# Altium schematic sheet Magnetic_Encoder.SchDoc
size A
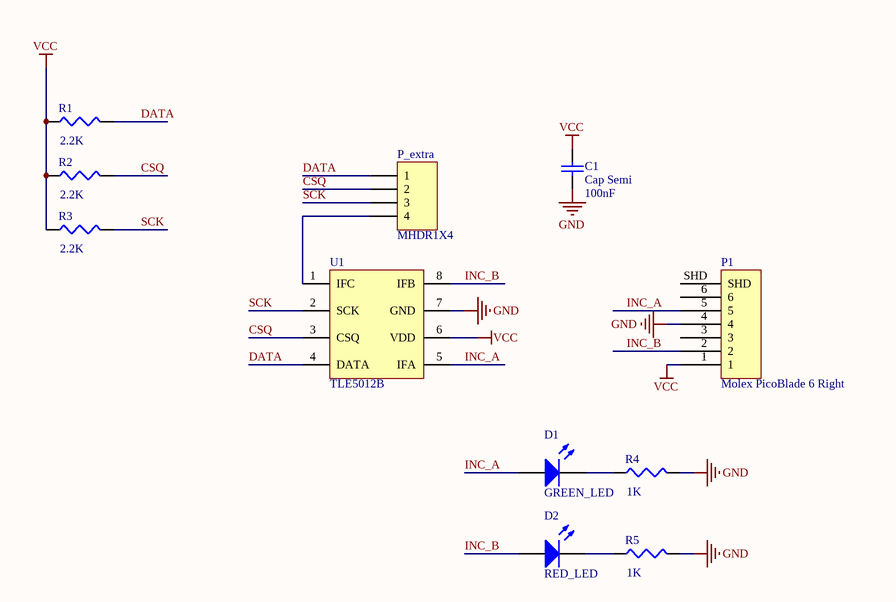
[diagram p0: Magnetic_Encoder.SchDoc]

## Parts
C1  Cap Semi  value 100nF  [1608[0603]]
D1  GREEN_LED  [1608[0603]]
D2  RED_LED  [1608[0603]]
P1  Molex PicoBlade 6 Right  [Molex PicoBlade 6 Right SMD]
P_extra  MHDR1X4  [MHDR1X4]
R1  value 2.2K  [J1-0603]  (hidden comment: Res3)
R2  value 2.2K  [J1-0603]  (hidden comment: Res3)
R3  value 2.2K  [J1-0603]  (hidden comment: Res3)
R4  value 1K  [J1-0603]  (hidden comment: Res3)
R5  value 1K  [J1-0603]  (hidden comment: Res3)
U1  TLE5012B  [SO-8]

## Nets
GND: C1.1 P1.4 R4.2 R5.2 U1.7(GND)
VCC: C1.2 P1.1 R1.1 R2.1 R3.1 U1.6(VDD)
CSQ: P_extra.2 R2.2 U1.3(CSQ)
DATA: P_extra.1 R1.2 U1.4(DATA)
INC_A: D1.1(A) P1.5 U1.5(IFA)
INC_B: D2.1(A) P1.2 U1.8(IFB)
SCK: P_extra.3 R3.2 U1.2(SCK)
NetD1_2: D1.2(K) R4.1
NetD2_2: D2.2(K) R5.1
NetP_extra_4: P_extra.4 U1.1(IFC)

Not connected (* = marked no-connect by the designer): P1 3 6 SHD

## Library data of the parts
C1 = Cap Semi: Capacitor (Semiconductor SIM Model); Published: 8-Jun-2000; LatestRevisionDate: 29-May-2009; LatestRevisionNote: IPC-7351 Footprint Added.; PackageReference: C1206; Publisher: Altium Limited; PackageDescription: Chip Capacitor
D1 D2 = LED2: Typical RED, GREEN, YELLOW, AMBER GaAs LED; Published: 8-Jun-2000; LatestRevisionDate: 17-Jul-2002; LatestRevisionNote: Re-released for DXP Platform.; PackageVersion: Feb-2002; PackageReference: 3.2X1.6X1.1; Publisher: Altium Limited; PackageDescription: SM LED; 2 Flat Leads
P_extra = MHDR1X4: Header, 4-Pin; LatestRevisionDate: 17-Jul-2002; LatestRevisionNote: Re-released for DXP Platform.; Publisher: Altium Limited
R1-R5 = Res3: Resistor; Published: 8-Jun-2000; LatestRevisionDate: 29-May-2009; LatestRevisionNote: IPC-7351 Footprint Added.; PackageReference: J1-0603; Publisher: Altium Limited; PackageDescription: Chip Resistor
U1 = TLE5012B: TLE5012BE1000XUMA1